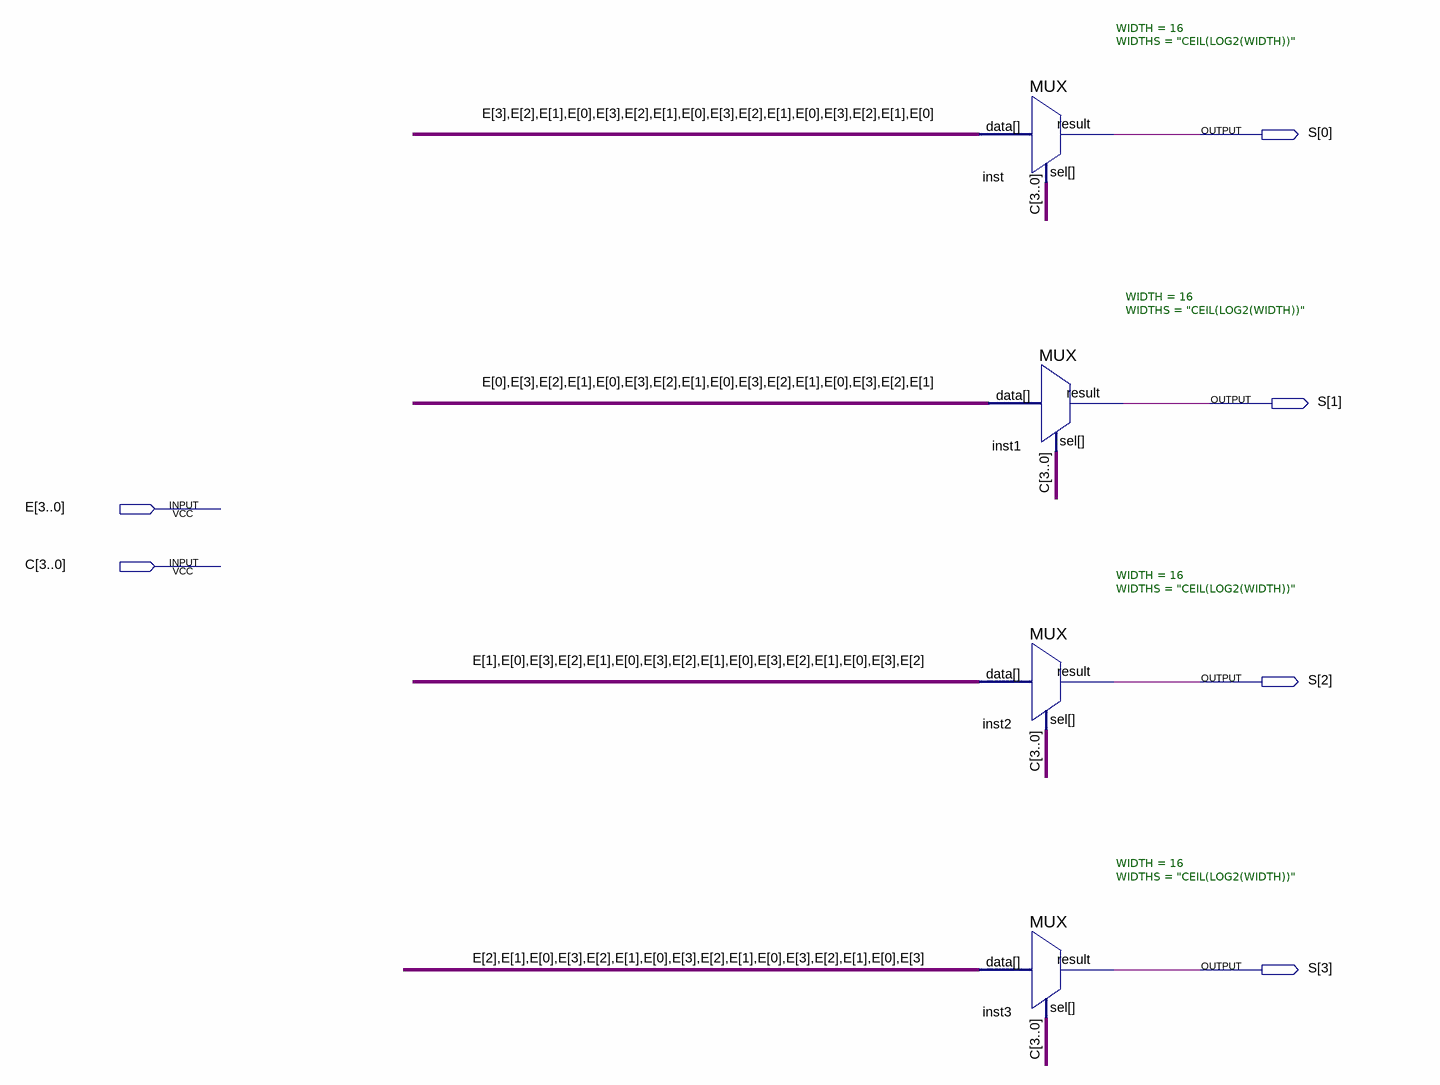
[diagram p0: schematic sheet]
// Quartus schematic rot_r.bdf as structural Verilog: 4 symbols, 6 pins
module rot_r (
  input  [3:0] E,
  input  [3:0] C,
  output [3:0] S
);

  MUX #(.WIDTH(16), .WIDTHS("CEIL(LOG2(WIDTH))")) inst (.data({E, E, E, E}), .sel(C), .result(S[0]));
  MUX #(.WIDTH(16), .WIDTHS("CEIL(LOG2(WIDTH))")) inst1 (.data({E[0], E, E, E, E[3:1]}), .sel(C), .result(S[1]));
  MUX #(.WIDTH(16), .WIDTHS("CEIL(LOG2(WIDTH))")) inst2 (.data({E[1:0], E, E, E, E[3:2]}), .sel(C), .result(S[2]));
  MUX #(.WIDTH(16), .WIDTHS("CEIL(LOG2(WIDTH))")) inst3 (.data({E[2:0], E, E, E, E[3]}), .sel(C), .result(S[3]));
endmodule
